# Altium schematic sheet FPGA-1.SchDoc
size A3; Date: Date; CompanyName: HESSO; Engineer: Name; Address1: Route du Rawyl 47; Address2: 1950 Sion; Address3: Switzerland; ProjectName: Project Name
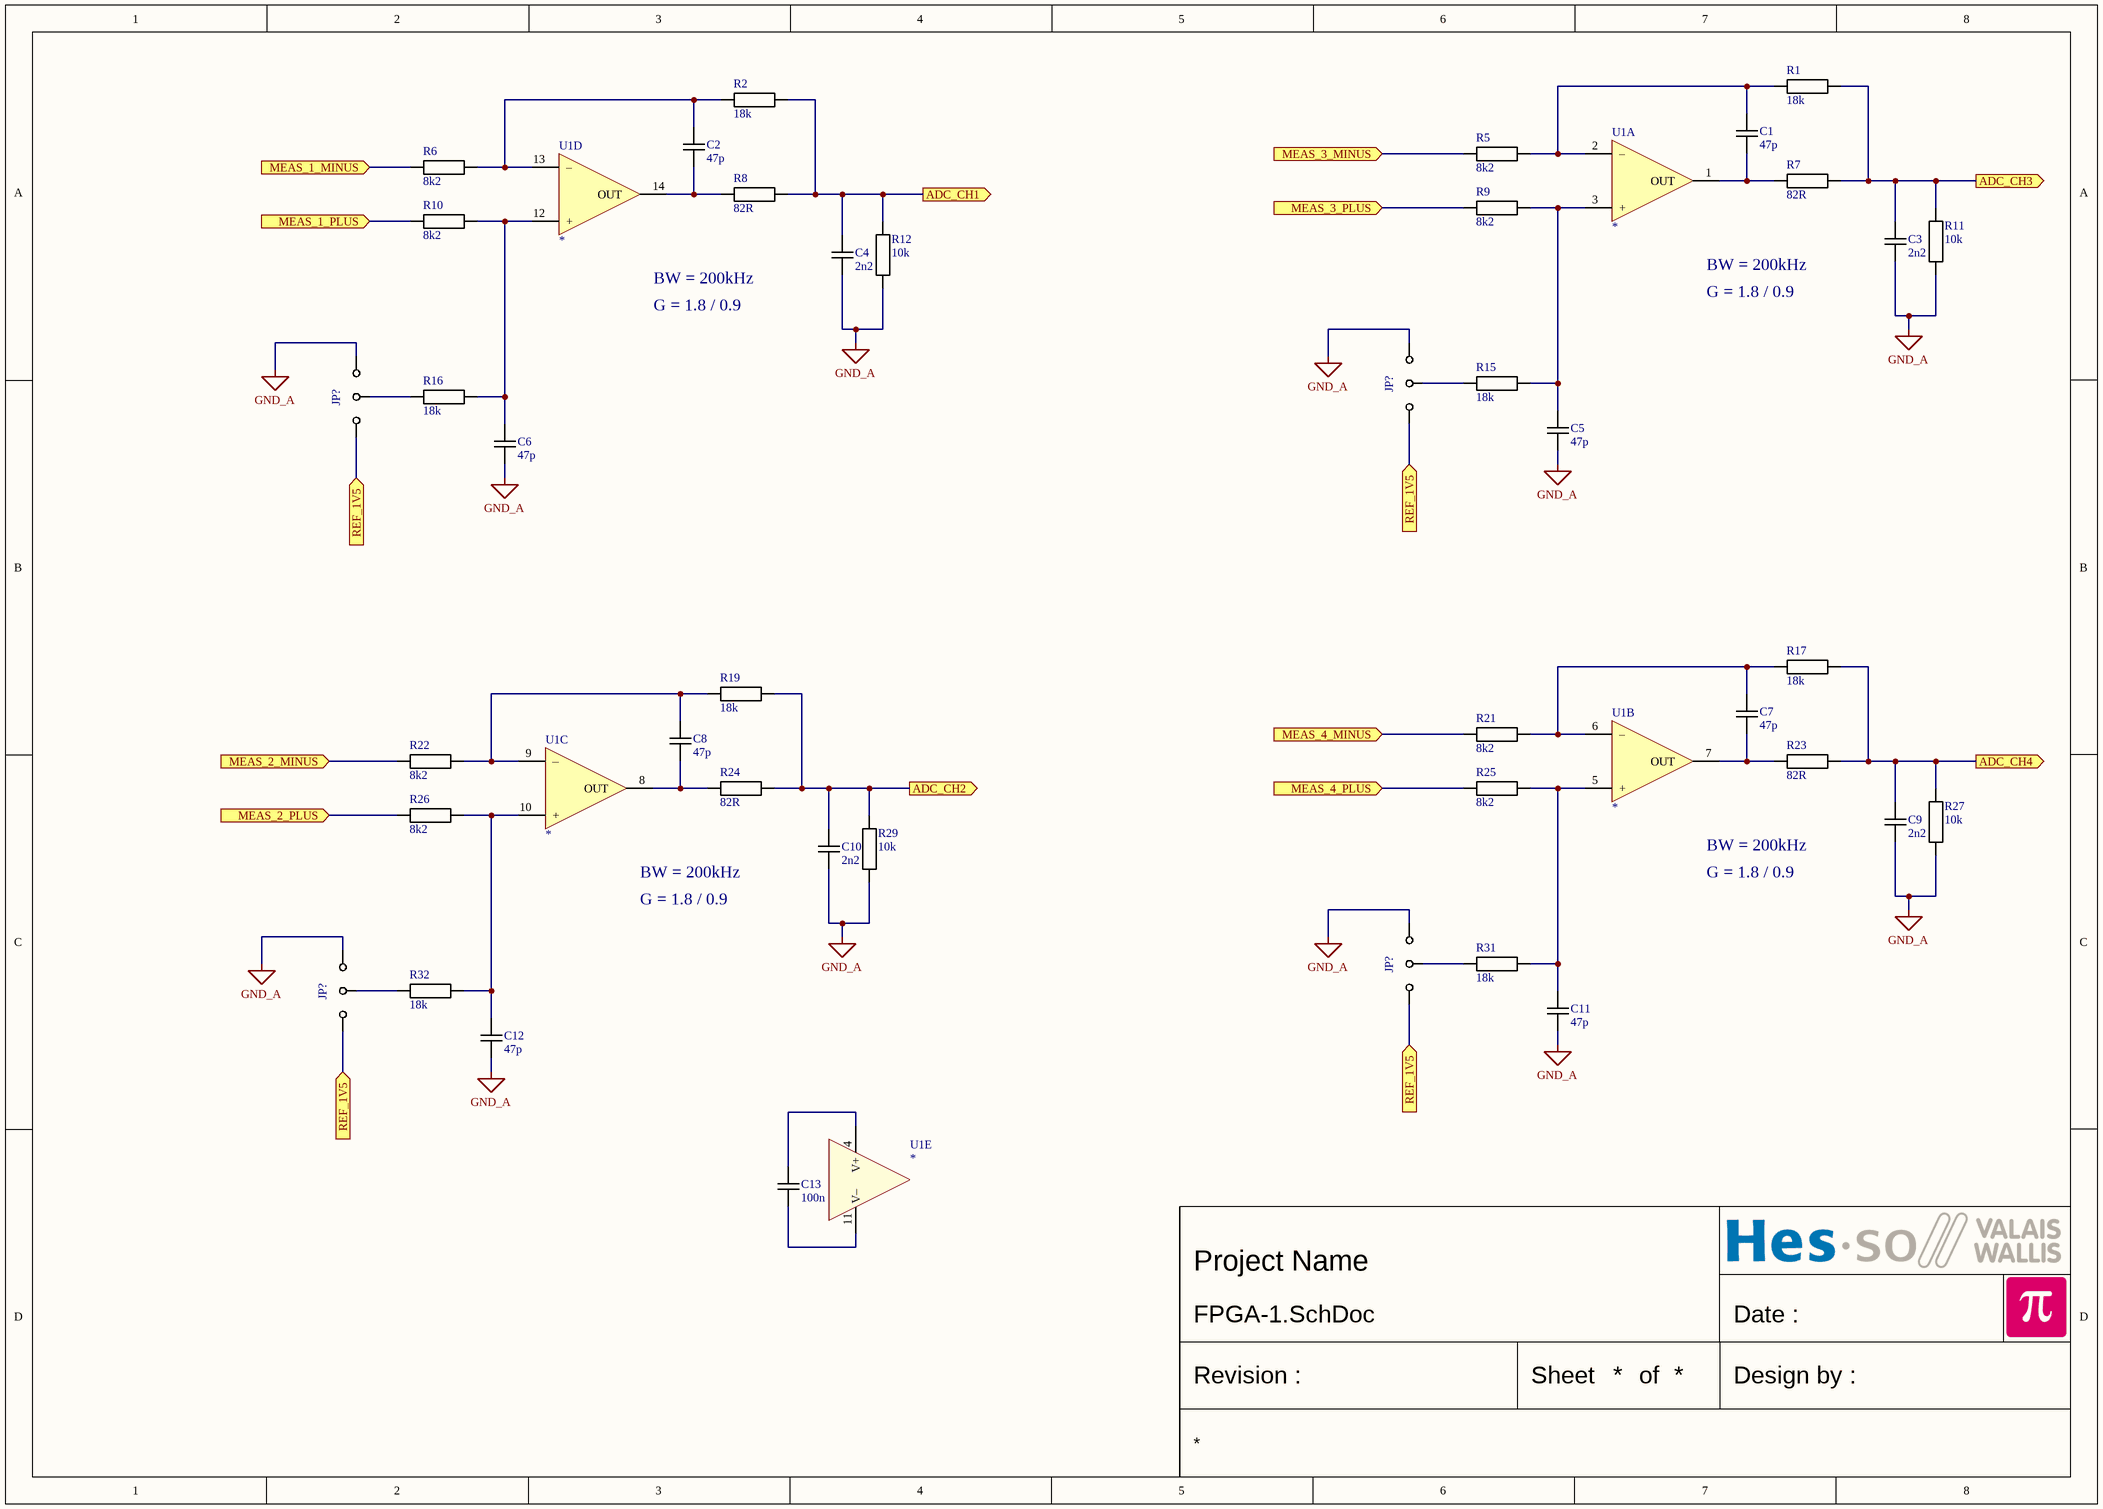
[diagram p0: FPGA-1.SchDoc]

## Parts
(Parts that share a designator on the sheet are numbered #1, #2 ... from top to bottom, then left to right.)
C1  47p  [CAPACITOR 1608 REFLOW]
C2  47p  [CAPACITOR 1608 REFLOW]
C3  2n2  [CAPACITOR 1608 REFLOW]
C4  2n2  [CAPACITOR 1608 REFLOW]
C5  47p  [CAPACITOR 1608 REFLOW]
C6  47p  [CAPACITOR 1608 REFLOW]
C7  47p  [CAPACITOR 1608 REFLOW]
C8  47p  [CAPACITOR 1608 REFLOW]
C9  2n2  [CAPACITOR 1608 REFLOW]
C10  2n2  [CAPACITOR 1608 REFLOW]
C11  47p  [CAPACITOR 1608 REFLOW]
C12  47p  [CAPACITOR 1608 REFLOW]
C13  100n  [CAPACITOR 1608 REFLOW]
JP?#1  {Value}  [JUMPER3 SMD 1608]  (value not drawn)
JP?#2  {Value}  [JUMPER3 SMD 1608]  (value not drawn)
JP?#3  {Value}  [JUMPER3 SMD 1608]  (value not drawn)
JP?#4  {Value}  [JUMPER3 SMD 1608]  (value not drawn)
R1  18k  [RESISTOR 1608 REFLOW]
R2  18k  [RESISTOR 1608 REFLOW]
R5  8k2  [RESISTOR 1608 REFLOW]
R6  8k2  [RESISTOR 1608 REFLOW]
R7  82R  [RESISTOR 1608 REFLOW]
R8  82R  [RESISTOR 1608 REFLOW]
R9  8k2  [RESISTOR 1608 REFLOW]
R10  8k2  [RESISTOR 1608 REFLOW]
R11  10k  [RESISTOR 1608 REFLOW]
R12  10k  [RESISTOR 1608 REFLOW]
R15  18k  [RESISTOR 1608 REFLOW]
R16  18k  [RESISTOR 1608 REFLOW]
R17  18k  [RESISTOR 1608 REFLOW]
R19  18k  [RESISTOR 1608 REFLOW]
R21  8k2  [RESISTOR 1608 REFLOW]
R22  8k2  [RESISTOR 1608 REFLOW]
R23  82R  [RESISTOR 1608 REFLOW]
R24  82R  [RESISTOR 1608 REFLOW]
R25  8k2  [RESISTOR 1608 REFLOW]
R26  8k2  [RESISTOR 1608 REFLOW]
R27  10k  [RESISTOR 1608 REFLOW]
R29  10k  [RESISTOR 1608 REFLOW]
R31  18k  [RESISTOR 1608 REFLOW]
R32  18k  [RESISTOR 1608 REFLOW]
U1  *  [SO14 P1.27 C4.0X8.8 H1.75]  (parts A,B,C,D,E of 5)

## Ports
ADC_CH1 (out), ADC_CH2 (out), ADC_CH3 (out), ADC_CH4 (out), MEAS_1_MINUS (in), MEAS_1_PLUS (in), MEAS_2_MINUS (in), MEAS_2_PLUS (in), MEAS_3_MINUS (in), MEAS_3_PLUS (in), MEAS_4_MINUS (in), MEAS_4_PLUS (in), REF_1V5 (in)

## Nets
GND_A: C3.1 C4.1 C5.1 C6.1 C9.1 C10.1 C11.1 C12.1 JP?#1.3 JP?#2.3 JP?#3.3 JP?#4.3 R11.2 R12.2 R27.2 R29.2
ADC_CH1: C4.2 R2.2 R8.2 R12.1 ; port ADC_CH1
ADC_CH2: C10.2 R19.2 R24.2 R29.1 ; port ADC_CH2
ADC_CH3: C3.2 R1.2 R7.2 R11.1 ; port ADC_CH3
ADC_CH4: C9.2 R17.2 R23.2 R27.1 ; port ADC_CH4
MEAS_1_MINUS: R6.1 ; port MEAS_1_MINUS
MEAS_1_PLUS: R10.1 ; port MEAS_1_PLUS
MEAS_2_MINUS: R22.1 ; port MEAS_2_MINUS
MEAS_2_PLUS: R26.1 ; port MEAS_2_PLUS
MEAS_3_MINUS: R5.1 ; port MEAS_3_MINUS
MEAS_3_PLUS: R9.1 ; port MEAS_3_PLUS
MEAS_4_MINUS: R21.1 ; port MEAS_4_MINUS
MEAS_4_PLUS: R25.1 ; port MEAS_4_PLUS
REF_1V5: JP?#1.1 JP?#2.1 JP?#3.1 JP?#4.1 ; port REF_1V5
NetC1_1: C1.1 R7.1 U1.1(OUT)
NetC1_2: C1.2 R1.1 R5.2 U1.2(–)
NetC2_1: C2.1 R8.1 U1.14(OUT)
NetC2_2: C2.2 R2.1 R6.2 U1.13(–)
NetC5_2: C5.2 R9.2 R15.1 U1.3(+)
NetC6_2: C6.2 R10.2 R16.1 U1.12(+)
NetC7_1: C7.1 R23.1 U1.7(OUT)
NetC7_2: C7.2 R17.1 R21.2 U1.6(–)
NetC8_1: C8.1 R24.1 U1.8(OUT)
NetC8_2: C8.2 R19.1 R22.2 U1.9(–)
NetC11_2: C11.2 R25.2 R31.1 U1.5(+)
NetC12_2: C12.2 R26.2 R32.1 U1.10(+)
NetC13_1: C13.1 U1.11(V–)
NetC13_2: C13.2 U1.4(V+)
NetJP?#1_2: JP?#1.2 R15.2
NetJP?#2_2: JP?#2.2 R16.2
NetJP?#3_2: JP?#3.2 R31.2
NetJP?#4_2: JP?#4.2 R32.2

## Notes on the sheet
- BW = 200kHz
- G = 1.8 / 0.9
- Date :
- Revision :
- Sheet
- of
- Design by :

## Library data of the parts
C1-C13 = Capacitor: Capacitor X7R 10% 50V 1608(0603)
  C1 C2 C5-C8 C11 C12: Value: 47p
  C3 C4 C9 C10: Value: 2n2
  C13: Value: 100n
JP?#1-JP?#4 = JUMPER 3 POS: Value: {Value}
R1 R2 R5-R12 R15-R17 R19 R21-R27 R29 R31 R32 = Resistor: Resistor 1% 50V 100mW 1608(0603)
  R1 R2 R15-R17 R19 R31 R32: Value: 18k
  R5 R6 R9 R10 R21 R22 R25 R26: Value: 8k2
  R7 R8 R23 R24: Value: 82R
  R11 R12 R27 R29: Value: 10k
U1 = OPA QUAD: Generic quad OPA 14 pins; Value: *